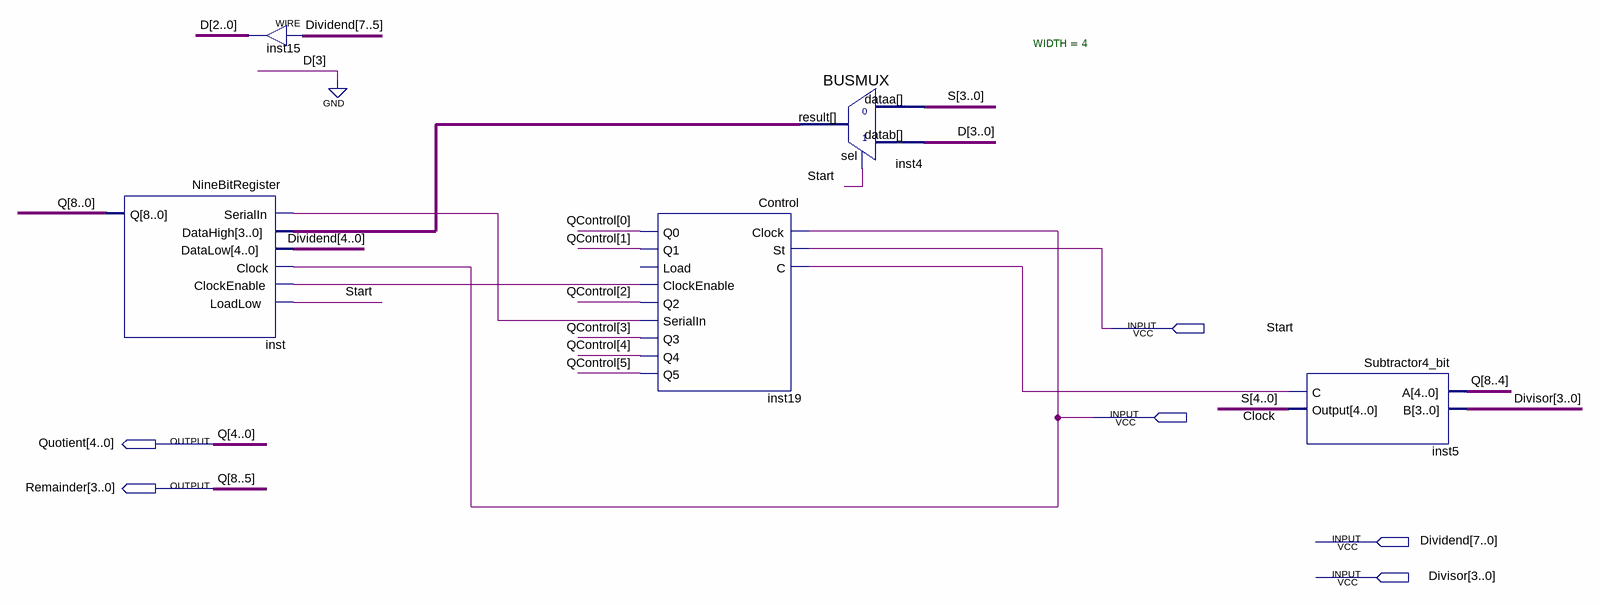
[diagram p0: schematic sheet]
// Quartus schematic Divider.bdf as structural Verilog: 5 symbols, 6 pins
module Divider (
  input  Start,
  input  Clock,
  input  [7:0] Dividend,
  input  [3:0] Divisor,
  output [4:0] Quotient,
  output [3:0] Remainder
);

  wire inst5_c, inst19_clockenable, inst19_serialin;
  wire [2:0] D;
  wire [3:0] inst4_result;
  wire [4:0] S;
  wire [5:0] QControl;

  NineBitRegister inst (
    .SerialIn(inst19_serialin), .DataHigh(inst4_result), .DataLow(Dividend[4:0]), .Clock(Clock),
    .ClockEnable(inst19_clockenable), .LoadLow(Start), .Q({Remainder, Quotient}));
  assign D = Dividend[7:5];  // WIRE inst15
  Control inst19 (
    .Clock(Clock), .St(Start), .C(inst5_c), .Q0(QControl[0]), .Q1(QControl[1]),
    .ClockEnable(inst19_clockenable), .Q2(QControl[2]), .SerialIn(inst19_serialin), .Q3(QControl[3]),
    .Q4(QControl[4]), .Q5(QControl[5]));  // open: Load
  BUSMUX #(.WIDTH(4)) inst4 (.datab({1'b0, D}), .sel(Start), .dataa(S[3:0]), .result(inst4_result));
  Subtractor4_bit inst5 (.A({Remainder, Quotient[4]}), .B(Divisor), .C(inst5_c), .Output(S));

  // Other names for the same wires on the sheet: Q[8:0] = {Remainder, Quotient}
endmodule
